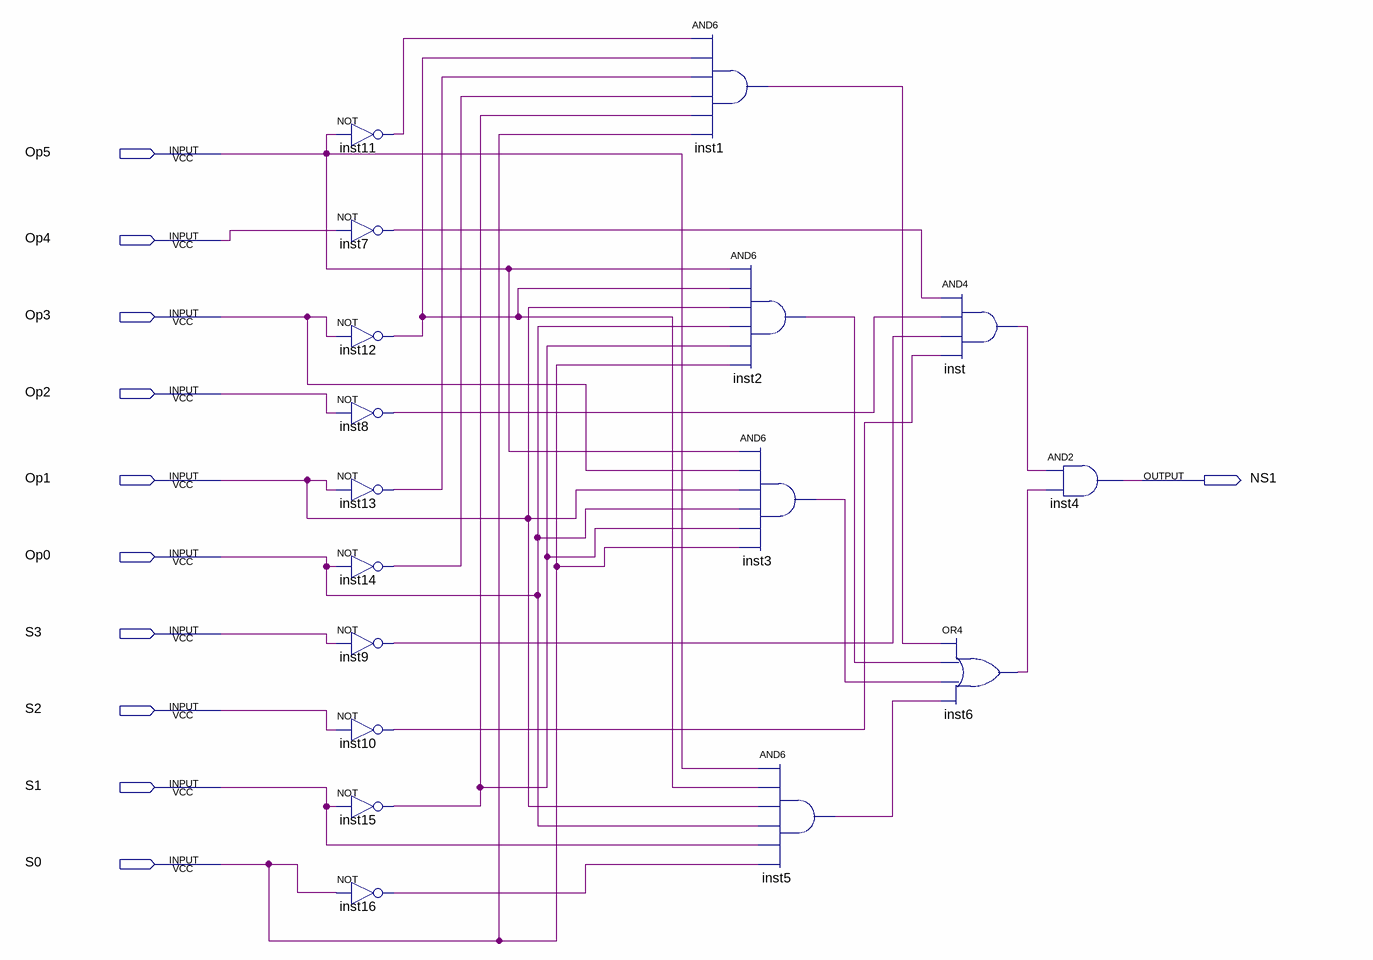
[diagram p0: schematic sheet]
// Quartus schematic NS1.bdf as structural Verilog: 17 symbols, 11 pins
module NS1 (
  input  Op5,
  input  Op4,
  input  Op3,
  input  Op2,
  input  Op1,
  input  Op0,
  input  S3,
  input  S2,
  input  S1,
  input  S0,
  output NS1
);

  wire inst1_out, inst2_out, inst3_out, inst5_out, inst6_out, inst7_out, inst8_out, inst9_out, inst10_out,
       inst11_out, inst12_out, inst13_out, inst14_out, inst15_out, inst16_out, inst_out;

  not inst11 (inst11_out, Op5);
  not inst7 (inst7_out, Op4);
  not inst12 (inst12_out, Op3);
  not inst8 (inst8_out, Op2);
  not inst13 (inst13_out, Op1);
  not inst14 (inst14_out, Op0);
  not inst9 (inst9_out, S3);
  not inst10 (inst10_out, S2);
  not inst15 (inst15_out, S1);
  not inst16 (inst16_out, S0);
  and inst1 (inst1_out, inst11_out, inst12_out, inst13_out, inst14_out, inst15_out, S0);
  and inst2 (inst2_out, Op5, inst12_out, Op1, Op0, inst15_out, S0);
  and inst3 (inst3_out, Op5, Op3, Op1, Op0, inst15_out, S0);
  and inst5 (inst5_out, Op5, inst12_out, Op1, Op0, S1, inst16_out);
  and inst (inst_out, inst7_out, inst8_out, inst9_out, inst10_out);
  or inst6 (inst6_out, inst1_out, inst2_out, inst3_out, inst5_out);
  and inst4 (NS1, inst_out, inst6_out);
endmodule
